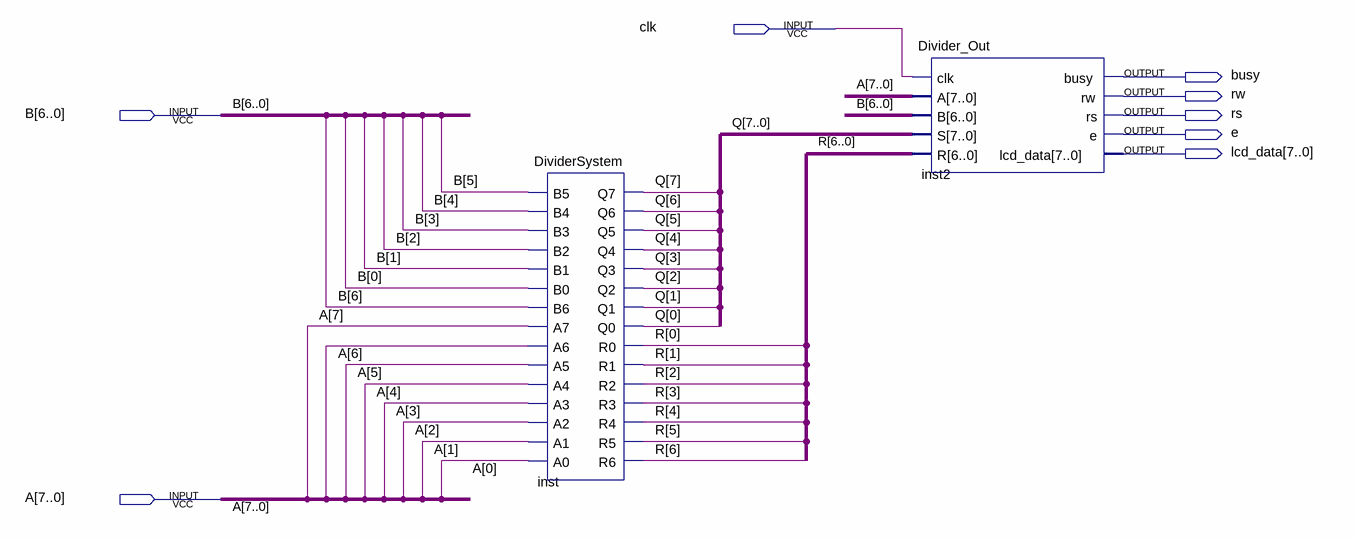
[diagram p0: schematic sheet]
// Quartus schematic Full_System.bdf as structural Verilog: 2 symbols, 8 pins
module Full_System (
  input  clk,
  input  [6:0] B,
  input  [7:0] A,
  output busy,
  output rw,
  output rs,
  output e,
  output [7:0] lcd_data
);

  wire [6:0] R;
  wire [7:0] Q;

  DividerSystem inst (
    .B5(B[5]), .B4(B[4]), .B3(B[3]), .B2(B[2]), .B1(B[1]), .B0(B[0]), .B6(B[6]), .A7(A[7]), .A6(A[6]),
    .A5(A[5]), .A4(A[4]), .A3(A[3]), .A2(A[2]), .A1(A[1]), .A0(A[0]), .Q7(Q[7]), .Q6(Q[6]), .Q5(Q[5]),
    .Q4(Q[4]), .Q3(Q[3]), .Q2(Q[2]), .Q1(Q[1]), .Q0(Q[0]), .R0(R[0]), .R1(R[1]), .R2(R[2]), .R3(R[3]),
    .R4(R[4]), .R5(R[5]), .R6(R[6]));
  Divider_Out inst2 (.clk(clk), .A(A), .B(B), .S(Q), .R(R), .busy(busy), .rw(rw), .rs(rs), .e(e), .lcd_data(lcd_data));
endmodule
